# Altium schematic sheet Sensors + CAN.SchDoc: Init Title in DocParam
size A4; Organization: Use Organization_Name in ProjParam; Address1: Eliot Ferragni; Address2: STI-IMT-LSRO; Address3: EPFL; Address4: CH-1015 LAUSANNE; DocumentNumber: 6; Revision: A; SheetNumber: 6; SheetTotal: 10; ApprovedBy: Init ApprovedBy in DocParam; CheckedBy: Init CheckedBy in DocParam; Author: Init Author in DocParam; CompanyName: Init CompanyName in DocParam; DrawnBy: Init DrawBy in DocParam; Engineer: Init Engineer in DocParam; Title2: Init Title2 in DocParam; DocumentName: Init DocumentName in DocParam; ProjectName: Init ProjectName in DocParam
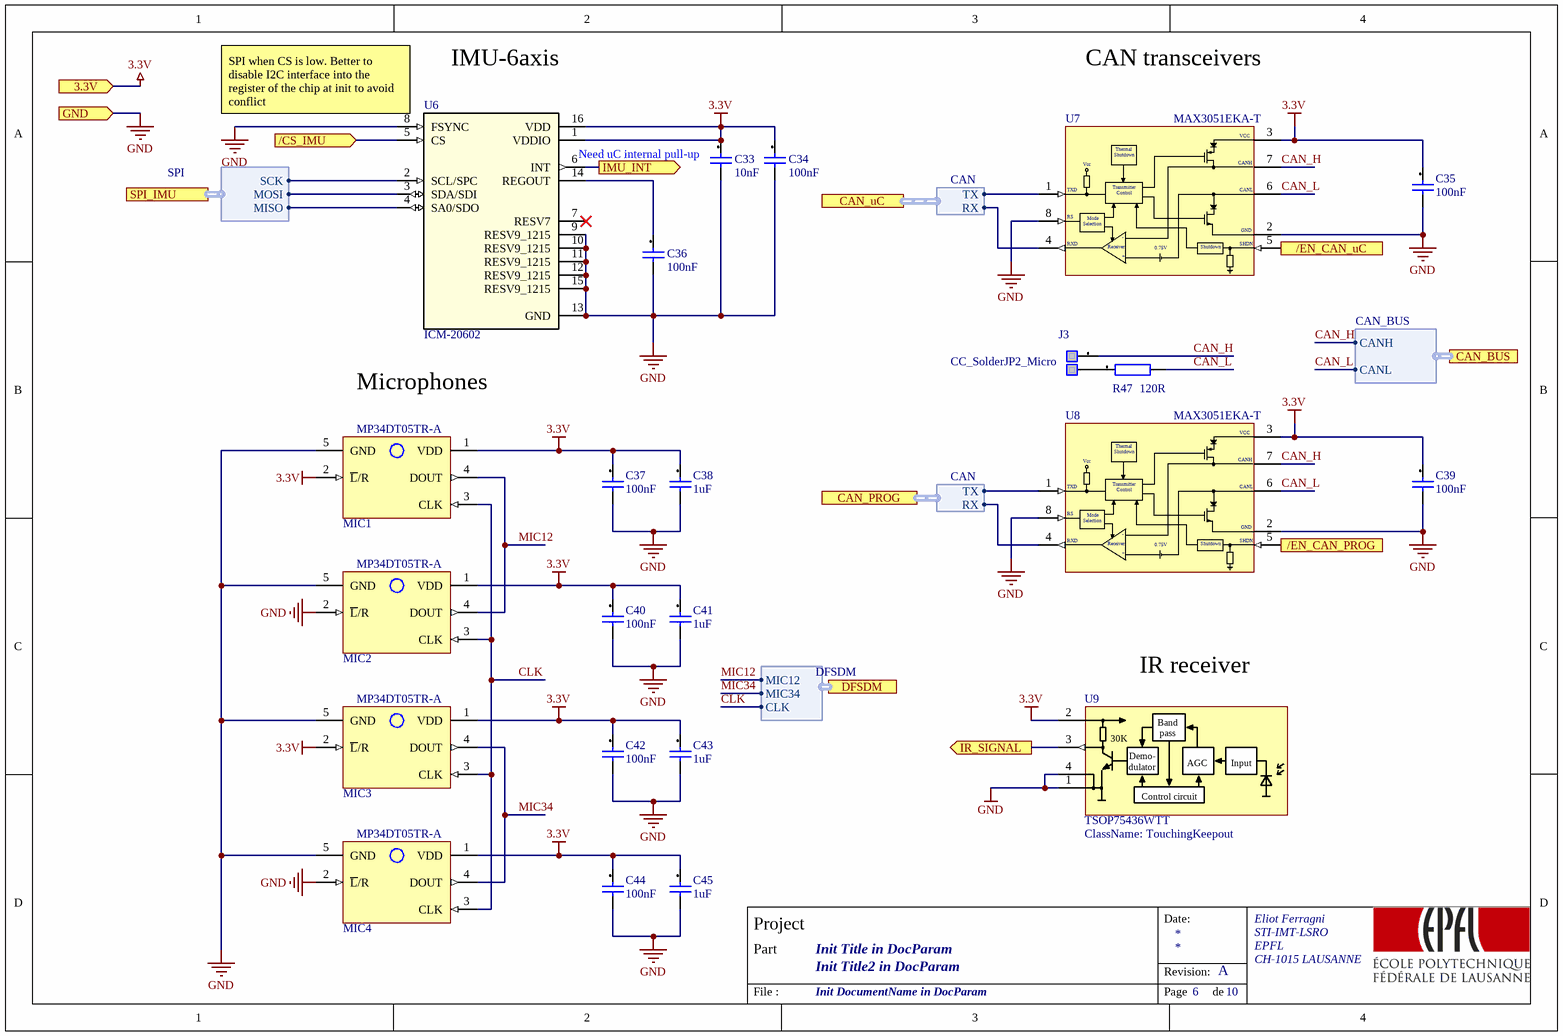
[diagram p0: Sensors + CAN.SchDoc]

## Parts
C33  10nF  [CAPC0201(0603)33_L]
C34  100nF  [CAPC0201(0603)33_L]
C35  100nF  [CAPC0201(0603)33_L]
C36  100nF  [CAPC0201(0603)33_L]
C37  100nF  [CAPC0201(0603)33_L]
C38  1uF  [CAPC0201(0603)33_L]
C39  100nF  [CAPC0201(0603)33_L]
C40  100nF  [CAPC0201(0603)33_L]
C41  1uF  [CAPC0201(0603)33_L]
C42  100nF  [CAPC0201(0603)33_L]
C43  1uF  [CAPC0201(0603)33_L]
C44  100nF  [CAPC0201(0603)33_L]
C45  1uF  [CAPC0201(0603)33_L]
J3  CC_SolderJP2_Micro  [CC_SolderJP_U]  (no BOM)
MIC1  MP34DT05TR-A  [MIC-PACK_MP34DT05-A(Primary)]
MIC2  MP34DT05TR-A  [MIC-PACK_MP34DT05-A(Primary)]
MIC3  MP34DT05TR-A  [MIC-PACK_MP34DT05-A(Primary)]
MIC4  MP34DT05TR-A  [MIC-PACK_MP34DT05-A(Primary)]
R47  120R  [RESC0201(0603)_L]
U6  ICM-20602  [PQFN50P300X300X80-16N]
U7  MAX3051EKA-T  [SOT23-8]
U8  MAX3051EKA-T  [SOT23-8]
U9  TSOP75436WTT  ClassName: TouchingKeepout  [VISHAY-TSOP752-754]

## Ports
3.3V (in), /CS_IMU (in), /EN_CAN_PROG (in), /EN_CAN_uC (in), CAN_BUS (harness CAN_BUS), CAN_PROG (harness CAN), CAN_uC (harness CAN), DFSDM (harness DFSDM), GND (in), IMU_INT (out), IR_SIGNAL (out), SPI_IMU (harness SPI)

## Harnesses
SPI: MISO, MOSI, SCK
CAN: TX, RX
CAN_BUS: CANH, CANL
DFSDM: MIC34, MIC12, CLK

## Nets
3.3V: C33.1 C34.1 C35.1 C37.1 C38.1 C39.1 C40.1 C41.1 C42.1 C43.1 C44.1 C45.1 MIC1.1(VDD) MIC1.2(~{L}/R) MIC2.1(VDD) MIC3.1(VDD) MIC3.2(~{L}/R) MIC4.1(VDD) U6.1(VDDIO) U6.16(VDD) U7.3(VCC) U8.3(VCC) U9.2(VS) ; port 3.3V
GND: C33.2 C34.2 C35.2 C36.2 C37.2 C38.2 C39.2 C40.2 C41.2 C42.2 C43.2 C44.2 C45.2 MIC1.5(GND) MIC2.2(~{L}/R) MIC2.5(GND) MIC3.5(GND) MIC4.2(~{L}/R) MIC4.5(GND) U6.8(FSYNC) U6.9(RESV9_1215) U6.10(RESV9_1215) U6.11(RESV9_1215) U6.12(RESV9_1215) U6.13(GND) U6.15(RESV9_1215) U7.2(GND) U7.8(RS) U8.2(GND) U8.8(RS) U9.1(GND) U9.4(GND) ; port GND
/CS_IMU: U6.5(CS) ; port /CS_IMU
/EN_CAN_PROG: U8.5(SHDN) ; port /EN_CAN_PROG
/EN_CAN_uC: U7.5(SHDN) ; port /EN_CAN_uC
CAN_H: J3.1 U7.7(CANH) U8.7(CANH) ; port CAN_BUS.CANH
CAN_L: R47.2 U7.6(CANL) U8.6(CANL) ; port CAN_BUS.CANL
CLK: MIC1.3(CLK) MIC2.3(CLK) MIC3.3(CLK) MIC4.3(CLK) ; port DFSDM.CLK
IMU_INT: U6.6(INT) ; port IMU_INT
IR_SIGNAL: U9.3(OUT) ; port IR_SIGNAL
MIC12: MIC1.4(DOUT) MIC2.4(DOUT) ; port DFSDM.MIC12
MIC34: MIC3.4(DOUT) MIC4.4(DOUT) ; port DFSDM.MIC34
NetC36_1: C36.1 U6.14(REGOUT)
NetJ3_2: J3.2 R47.1
NetU6_2: U6.2(SCL/SPC) ; port SPI_IMU.SCK
NetU6_3: U6.3(SDA/SDI) ; port SPI_IMU.MOSI
NetU6_4: U6.4(SA0/SDO) ; port SPI_IMU.MISO
NetU7_1: U7.1(TXD) ; port CAN_uC.TX
NetU7_4: U7.4(RXD) ; port CAN_uC.RX
NetU8_1: U8.1(TXD) ; port CAN_PROG.TX
NetU8_4: U8.4(RXD) ; port CAN_PROG.RX

Not connected (* = marked no-connect by the designer): U6 7(RESV7)*

## Notes on the sheet
- (near U6) SPI when CS is low. Better to disable I2C interface into the register of the chip at init to avoid conflict
- IMU-6axis
- CAN transceivers
- Need uC internal pull-up
- Microphones
- IR receiver
- Date:
- Project
- Part
- Revision:
- File :
- Page
- de
- (in symbol MAX3051EKA-T[[/\]]1) Thermal; Shutdown; Vcc; Transmitter; Control; Mode; Selection; -; Receiver; 0.75V; +
- (in symbol TSOP75436WTT[[/\]]1) 30K; Band / pass; AGC; Input; Demo- / dulator; Control circuit

## Library data of the parts
C33-C45 = TBD Capacitor[[/\]]0201[[/\]]1: Capacitor TBD 0201; Preference: 1; Currentie: CHF; Size: 0201; Footprint Acort: 0201; ROHS: True; DateLastUpdate: 2018-10-19 / 8:59:52 AM
J3 = CC_SolderJP2_Micro: Micro Solder Jumper 2 leads; Preference: 1; Footprint Acort: ToDefine; DateLastUpdate: 2008-02-26 / 09:57:0
MIC1-MIC4 = MP34DT05TR-A: MEMS AUD MIC SENSOR OMNI 4HCLGA; Manufacturer: STMicroelectronics; Output Type: Digital, PDM; Direction: Omnidirectional; Sensitivity: -26dB ±3dB @ 94dB SPL; S/N Ratio: 64dB; Port Location: Top; Shape: Rectangular; Supplier 1: Digi-Key; Manufacturer Part Number: MP34DT05TR-A; RoHS: Request Inventory Verification; Category: Audio Products; Stock 1: 3088; Pricing 1: 1=1.41, 10=1.117, 100=0.8855, 500=0.7535, 1000=0.704 (USD); Packaging: Cut Tape (CT); Part Status: Active; Type: MEMS (Silicon); Ratings: -; Termination: Solder Pads; Height (Max): 0.043" (1.10mm); ComponentLink1URL: http://www.st.com/content/ccc/resource/technical/document/datasheet/group3/c7/90/d3/f6/b7/e7/40/c8/DM00415595/files/DM00415595.pdf/jcr:content/translations/en.DM00415595.pdf; ComponentLink1Description: http://www.st.com/content/ccc/resource/technical/document/datasheet/group3/c7/90/d3/f6/b7/e7/40/c8/DM00415595/files/DM00415595.pdf/jcr:content/translations/en.DM00415595.pdf; Supplier Part Number 1: 497-17809-1-ND
R47 = TBD[[/\]]0201[[/\]]1: Resistor ToDo 0201; Preference: 1; Currentie: CHF; Size: 0201; Footprint Acort: 0201; ROHS: True; DateLastUpdate: 2018-10-19 / 9:06:49 AM
U6 = ICM-20602: IMU ACCEL/GYRO/TEMP I2C/SPI LGA; Manufacturer: TDK InvenSense; MF: TDK-InvenSense; Sensor Type: Accelerometer, Gyroscope, Temperature, 6 Axis; Output Type: I²C, SPI; MP: ICM-20602; Digi-Key_Purchase_URL: https://www.digikey.ch/product-detail/en/tdk-invensense/ICM-20602/1428-1060-1-ND/5872875?utm_source=snapeda&utm_medium=aggregator&utm_campaign=symbol; SnapEDA_Link: https://www.snapeda.com/parts/ICM-20602/TDK-InvenSense/view-part/?ref=snap; Package: PQFN-16 TDK-InvenSense; Digi-Key_Part_Number: 1428-1060-1-ND; Value: *; Supplier 1: Digi-Key; Manufacturer Part Number: ICM-20602; RoHS: RoHS Compliant; Category: Sensors, Transducers; Stock 1: 12892; Pricing 1: 1=5.72, 5=5.05, 10=4.46, 25=3.6184, 50=3.1978, 100=3.1136, 500=2.60866, 1000=2.44035 (USD); Part Status: Active; Operating Temperature: -40°C ~ 85°C (TA); ComponentLink1URL: http://www.invensense.com/wp-content/uploads/2016/10/DS-000176-ICM-20602-v1.0.pdf; ComponentLink1Description: http://www.invensense.com/wp-content/uploads/2016/10/DS-000176-ICM-20602-v1.0.pdf
U7 U8 = MAX3051EKA-T[[/\]]1: +3.3V, 1Mbps, Low-Supply-Current CAN Transceiver; Manufacturer: Maxim; Preference: 1; Currentie: CHF; Size: SOT23-8; Footprint Acort: ToDefine; Manufacturer Nr: MAX3051EKA-T; ROHS: True; DateLastUpdate: 2012-06-17 / 01:26:47
U9 = TSOP75436WTT[[/\]]1: Vishay 	TSOP75436WTT IR Receiver Modules for Remote Control Systems; Preference: 1; Quant_2: 50; Quant_3: 200; Currentie: CHF; Size: TSOP752-754; Footprint Acort: ToDefine; ComponentLink1URL: http://www.vishay.com/docs/82496/tsop752w.pdf; ComponentLink1Description: Datasheet; Supplier: Farnell; Supplier Nr: 2251419; ComponentLink2Description: Farnell link; ComponentLink2URL: http://ch.farnell.com/fr-CH/vishay/tsop75436wtt/recepteur-ir-heimdall-agc4-36khz/dp/2251419; Manufacturer: Vishay; Manufacturer Nr: TSOP75436WTT; Quant_1: 1; Price_1: 1.144; Price_2: 1.056; Price_3: 0.924; ROHS: True; DateLastUpdate: 2014-11-27 / 08:18:45